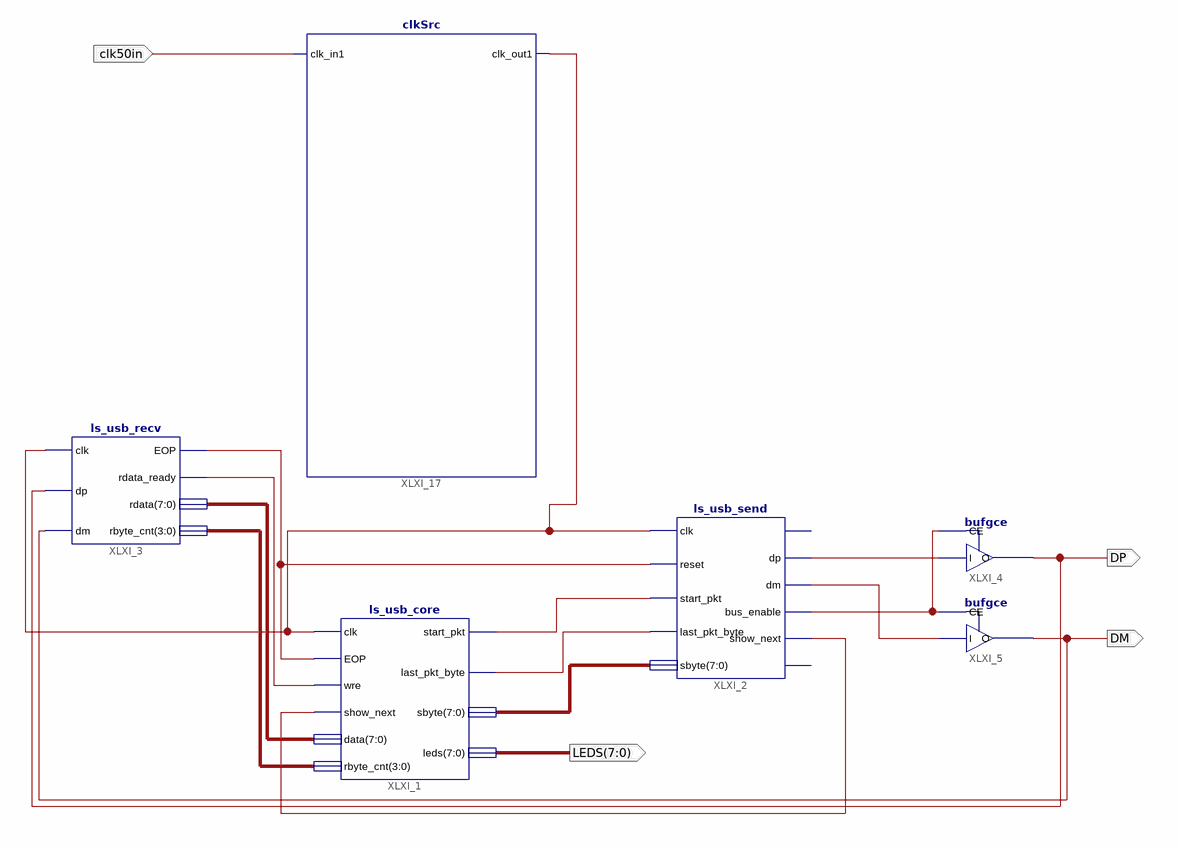
[diagram p0: schematic sheet 1]
// Xilinx ISE schematic simpleUsbDevice.sch (spartan6) as structural Verilog: 6 symbols, 4 ports
module simpleUsbDevice (
  input  clk50in,
  output DP,
  output DM,
  output [7:0] LEDS
);

  wire XLXN_2, XLXN_3, XLXN_6, XLXN_7, XLXN_8, XLXN_11, XLXN_12, XLXN_13, XLXN_54;
  wire [3:0] XLXN_4;
  wire [7:0] XLXN_1, XLXN_5;

  ls_usb_core XLXI_1 (
    .clk(XLXN_54), .EOP(XLXN_8), .wre(XLXN_6), .show_next(XLXN_7), .data(XLXN_5), .rbyte_cnt(XLXN_4),
    .start_pkt(XLXN_3), .last_pkt_byte(XLXN_2), .sbyte(XLXN_1), .leds(LEDS));
  ls_usb_send XLXI_2 (
    .clk(XLXN_54), .reset(XLXN_8), .start_pkt(XLXN_3), .last_pkt_byte(XLXN_2), .sbyte(XLXN_1), .dp(XLXN_11),
    .dm(XLXN_12), .bus_enable(XLXN_13), .show_next(XLXN_7));  // open: sbit, six_ones
  ls_usb_recv XLXI_3 (
    .clk(XLXN_54), .dp(DP), .dm(DM), .EOP(XLXN_8), .rdata_ready(XLXN_6), .rdata(XLXN_5), .rbyte_cnt(XLXN_4));
  bufgce XLXI_5 (.CE(XLXN_13), .I(XLXN_12), .O(DM));
  bufgce XLXI_4 (.CE(XLXN_13), .I(XLXN_11), .O(DP));
  clkSrc XLXI_17 (.clk_in1(clk50in), .clk_out1(XLXN_54));
endmodule
